# EAGLE schematic 7x6keyboard_untested (EAGLE 6.5.0)
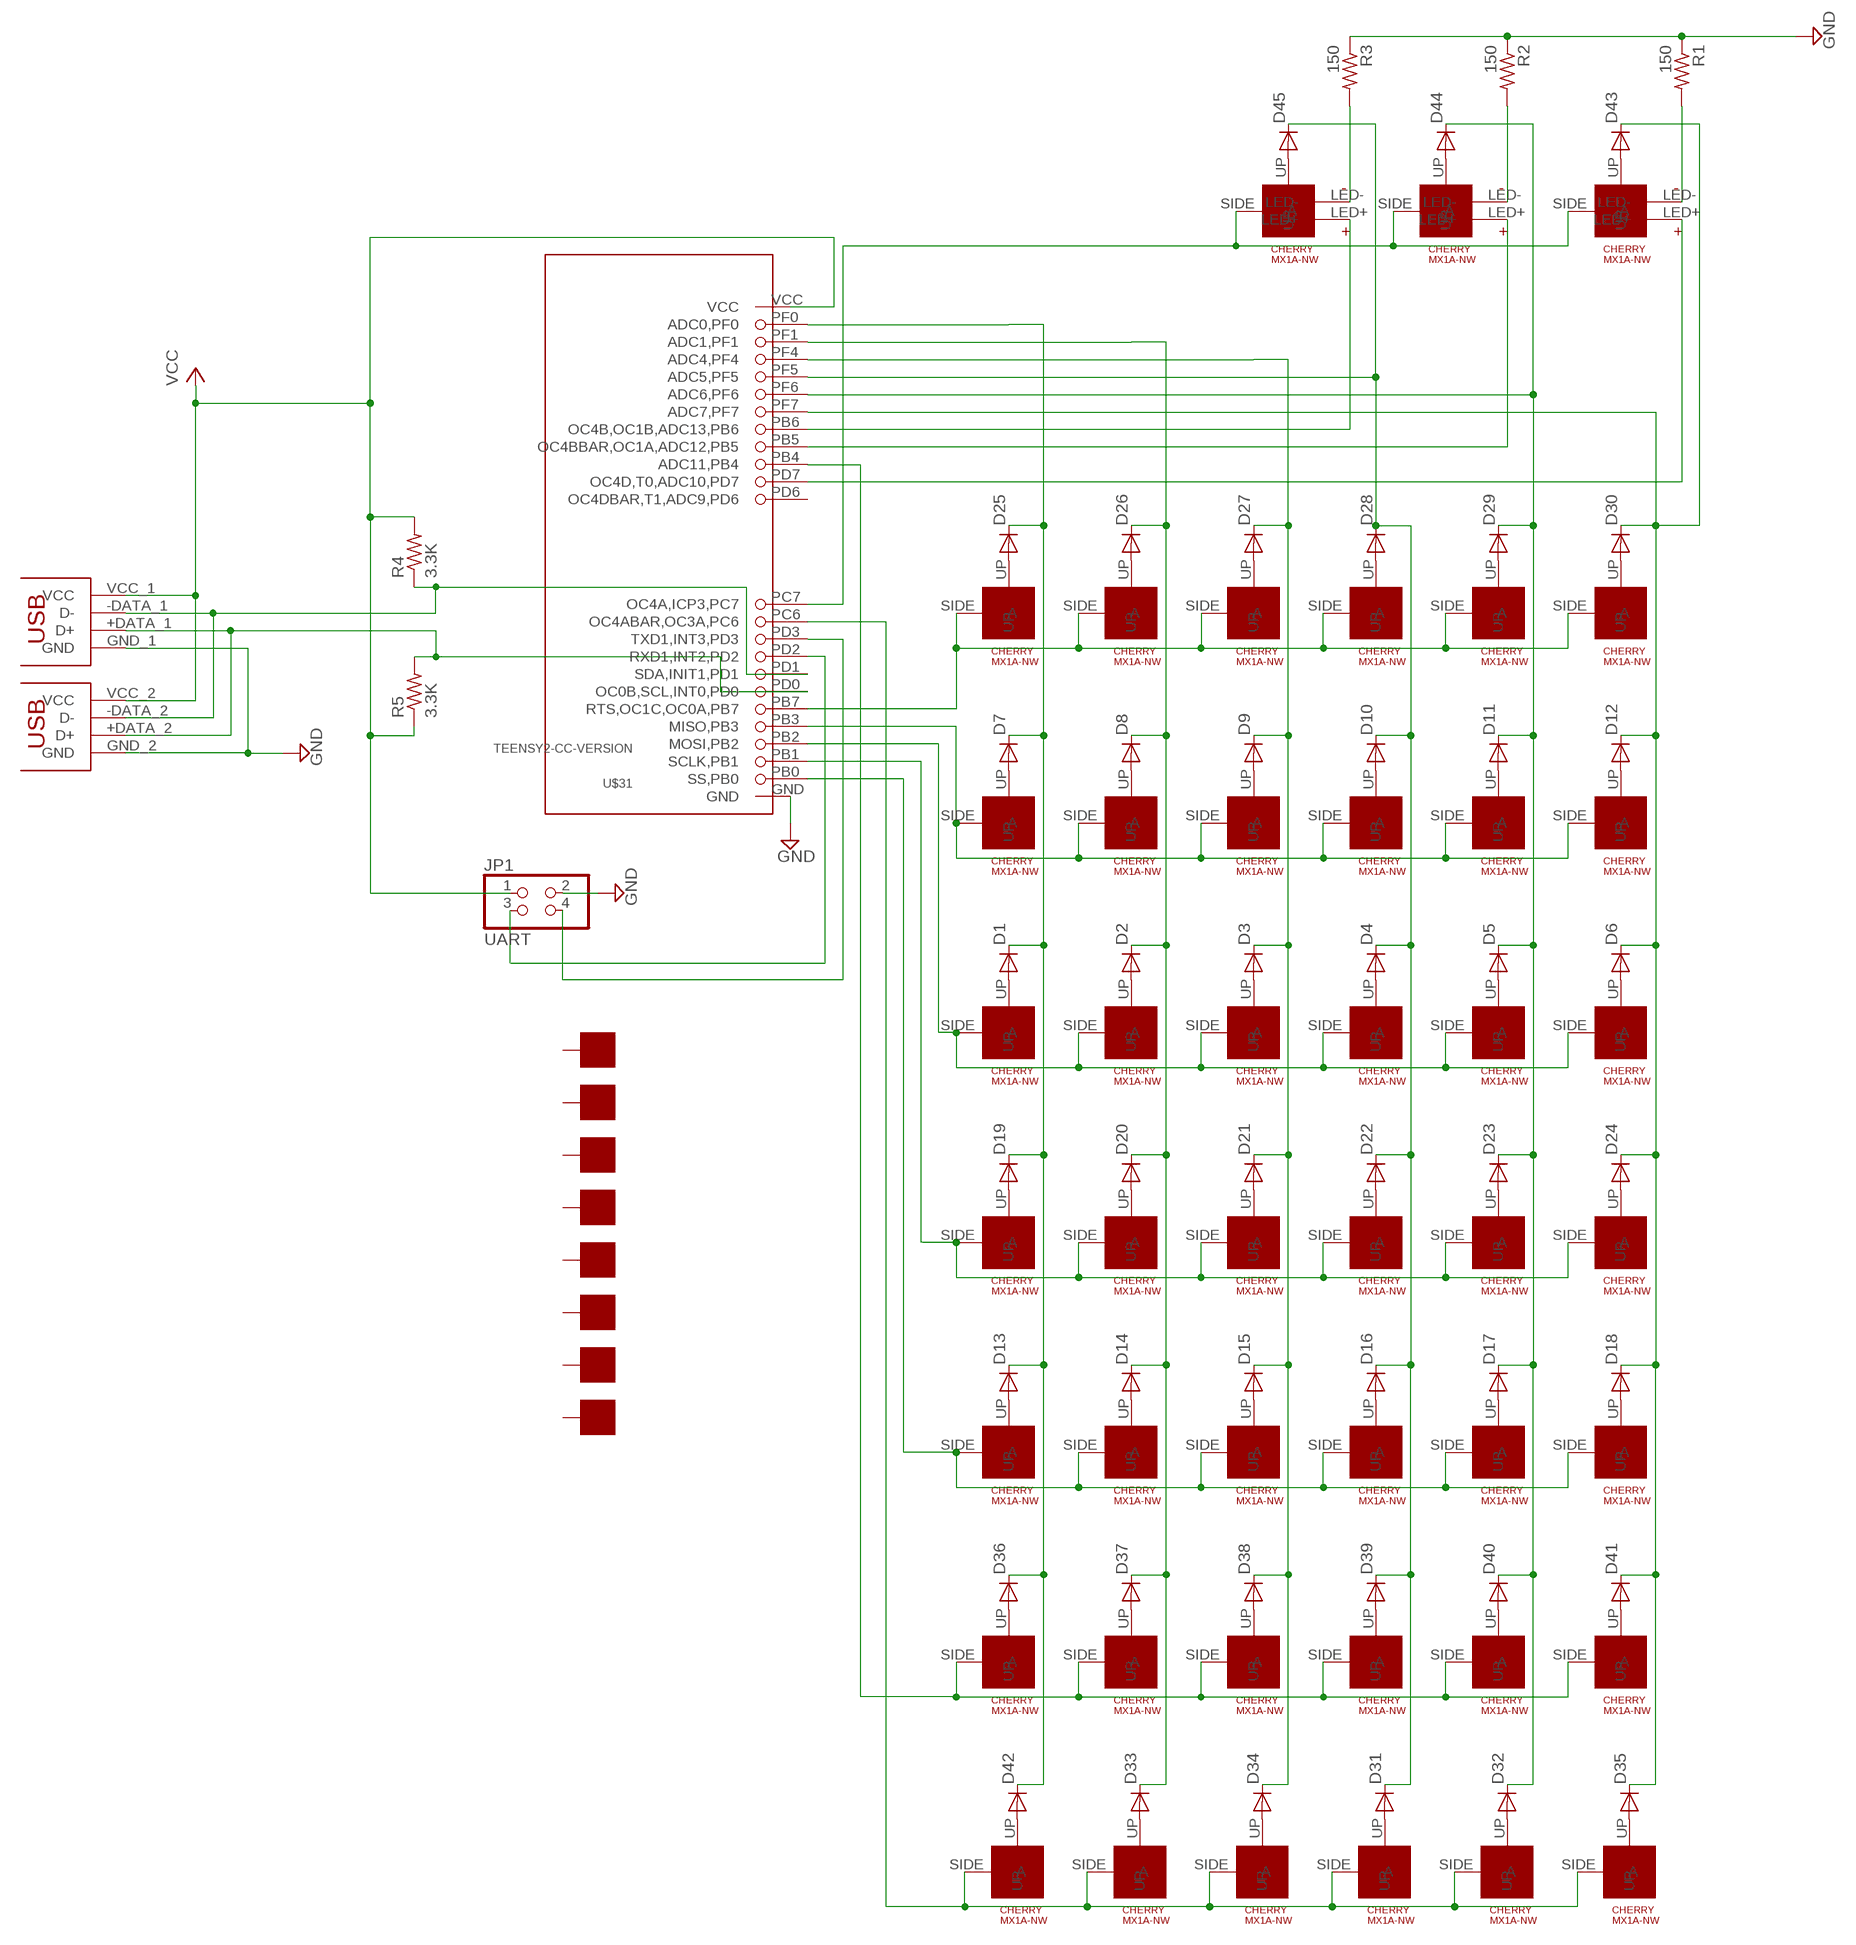
[diagram p0: schematic, sheet 1]

## Parts
D1  1N4148DO35-7  [DO35-7]
D2  1N4148DO35-7  [DO35-7]
D3  1N4148DO35-7  [DO35-7]
D4  1N4148DO35-7  [DO35-7]
D5  1N4148DO35-7  [DO35-7]
D6  1N4148DO35-7  [DO35-7]
D7  1N4148DO35-7  [DO35-7]
D8  1N4148DO35-7  [DO35-7]
D9  1N4148DO35-7  [DO35-7]
D10  1N4148DO35-7  [DO35-7]
D11  1N4148DO35-7  [DO35-7]
D12  1N4148DO35-7  [DO35-7]
D13  1N4148DO35-7  [DO35-7]
D14  1N4148DO35-7  [DO35-7]
D15  1N4148DO35-7  [DO35-7]
D16  1N4148DO35-7  [DO35-7]
D17  1N4148DO35-7  [DO35-7]
D18  1N4148DO35-7  [DO35-7]
D19  1N4148DO35-7  [DO35-7]
D20  1N4148DO35-7  [DO35-7]
D21  1N4148DO35-7  [DO35-7]
D22  1N4148DO35-7  [DO35-7]
D23  1N4148DO35-7  [DO35-7]
D24  1N4148DO35-7  [DO35-7]
D25  1N4148DO35-7  [DO35-7]
D26  1N4148DO35-7  [DO35-7]
D27  1N4148DO35-7  [DO35-7]
D28  1N4148DO35-7  [DO35-7]
D29  1N4148DO35-7  [DO35-7]
D30  1N4148DO35-7  [DO35-7]
D31  1N4148DO35-7  [DO35-7]
D32  1N4148DO35-7  [DO35-7]
D33  1N4148DO35-7  [DO35-7]
D34  1N4148DO35-7  [DO35-7]
D35  1N4148DO35-7  [DO35-7]
D36  1N4148DO35-7  [DO35-7]
D37  1N4148DO35-7  [DO35-7]
D38  1N4148DO35-7  [DO35-7]
D39  1N4148DO35-7  [DO35-7]
D40  1N4148DO35-7  [DO35-7]
D41  1N4148DO35-7  [DO35-7]
D42  1N4148DO35-7  [DO35-7]
D43  1N4148DO35-7  [DO35-7]
D44  1N4148DO35-7  [DO35-7]
D45  1N4148DO35-7  [DO35-7]
JP1  UART  PINHD-2X2  [2X02]
R1  150  R-US_0207/10  [0207/10]
R2  150  R-US_0207/10  [0207/10]
R3  150  R-US_0207/10  [0207/10]
R4  3.3K  R-US_0207/10  [0207/10]
R5  3.3K  R-US_0207/10  [0207/10]
U$1  CHERRY-MX1A-E1NW  [CHERRYMX-NN]
U$2  CHERRY-MX1A-E1NW  [CHERRYMX-NN]
U$3  CHERRY-MX1A-E1NW  [CHERRYMX-NN]
U$4  CHERRY-MX1A-E1NW  [CHERRYMX-NN]
U$5  CHERRY-MX1A-E1NW  [CHERRYMX-NN]
U$6  CHERRY-MX1A-E1NW  [CHERRYMX-NN]
U$7  CHERRY-MX1A-E1NW  [CHERRYMX-NN]
U$8  CHERRY-MX1A-E1NW  [CHERRYMX-NN]
U$9  CHERRY-MX1A-E1NW  [CHERRYMX-NN]
U$10  CHERRY-MX1A-E1NW  [CHERRYMX-NN]
U$11  CHERRY-MX1A-E1NW  [CHERRYMX-NN]
U$12  CHERRY-MX1A-E1NW  [CHERRYMX-NN]
U$13  CHERRY-MX1A-E1NW  [CHERRYMX-NN]
U$14  CHERRY-MX1A-E1NW  [CHERRYMX-NN]
U$15  CHERRY-MX1A-E1NW  [CHERRYMX-NN]
U$16  CHERRY-MX1A-E1NW  [CHERRYMX-NN]
U$17  CHERRY-MX1A-E1NW  [CHERRYMX-NN]
U$18  CHERRY-MX1A-E1NW  [CHERRYMX-NN]
U$19  CHERRY-MX1A-E1NW  [CHERRYMX-NN]
U$20  CHERRY-MX1A-E1NW  [CHERRYMX-NN]
U$21  CHERRY-MX1A-E1NW  [CHERRYMX-NN]
U$22  CHERRY-MX1A-E1NW  [CHERRYMX-NN]
U$23  CHERRY-MX1A-E1NW  [CHERRYMX-NN]
U$24  CHERRY-MX1A-E1NW  [CHERRYMX-NN]
U$25  CHERRY-MX1A-E1NW  [CHERRYMX-NN]
U$26  CHERRY-MX1A-E1NW  [CHERRYMX-NN]
U$27  CHERRY-MX1A-E1NW  [CHERRYMX-NN]
U$28  CHERRY-MX1A-E1NW  [CHERRYMX-NN]
U$29  CHERRY-MX1A-E1NW  [CHERRYMX-NN]
U$30  CHERRY-MX1A-E1NW  [CHERRYMX-NN]
U$31  TEENSY2-CC-VERSION  [TEENSY2]
U$32  CHERRY-MX1A-E1NW-LED  [CHERRYMX-NN-LED]
U$33  CHERRY-MX1A-E1NW-LED  [CHERRYMX-NN-LED]
U$34  CHERRY-MX1A-E1NW-LED  [CHERRYMX-NN-LED]
U$35  DUAL-USB-A  [DUAL-USB-A]
U$36  CHERRY-MX1A-E1NW  [CHERRYMX-NN]
U$37  CHERRY-MX1A-E1NW  [CHERRYMX-NN]
U$38  CHERRY-MX1A-E1NW  [CHERRYMX-NN]
U$39  CHERRY-MX1A-E1NW  [CHERRYMX-NN]
U$40  CHERRY-MX1A-E1NW  [CHERRYMX-NN]
U$41  CHERRY-MX1A-E1NW  [CHERRYMX-NN]
U$42  CHERRY-MX1A-E1NW  [CHERRYMX-NN]
U$43  CHERRY-MX1A-E1NW  [CHERRYMX-NN]
U$44  CHERRY-MX1A-E1NW  [CHERRYMX-NN]
U$45  CHERRY-MX1A-E1NW  [CHERRYMX-NN]
U$46  CHERRY-MX1A-E1NW  [CHERRYMX-NN]
U$47  CHERRY-MX1A-E1NW  [CHERRYMX-NN]
U$48  MOUNTING-PAD  [MOUNTING-PAD]
U$49  MOUNTING-PAD  [MOUNTING-PAD]
U$50  MOUNTING-PAD  [MOUNTING-PAD]
U$51  MOUNTING-PAD  [MOUNTING-PAD]
U$52  MOUNTING-PAD  [MOUNTING-PAD]
U$53  MOUNTING-PAD  [MOUNTING-PAD]
U$54  MOUNTING-PAD  [MOUNTING-PAD]
U$55  MOUNTING-PAD  [MOUNTING-PAD]

## Nets
GND: JP1.2 R1.1 R2.1 R3.1 U$31.GND U$35.GND_1(GND) U$35.GND_2(GND)
N$1: D1.A U$2.UP
N$2: D2.A U$1.UP
N$3: D3.A U$3.UP
N$4: D4.A U$4.UP
N$5: D5.A U$5.UP
N$6: D6.A U$6.UP
N$7: D7.A U$7.UP
N$8: D8.A U$8.UP
N$9: D9.A U$9.UP
N$10: D10.A U$10.UP
N$11: D11.A U$11.UP
N$12: D12.A U$12.UP
N$13: D13.A U$13.UP
N$14: D14.A U$14.UP
N$15: D15.A U$15.UP
N$16: D16.A U$16.UP
N$17: D17.A U$17.UP
N$18: D18.A U$18.UP
N$19: D19.A U$19.UP
N$20: D20.A U$20.UP
N$21: D21.A U$21.UP
N$22: D22.A U$22.UP
N$23: D23.A U$23.UP
N$24: D24.A U$24.UP
N$25: D25.A U$25.UP
N$26: D26.A U$26.UP
N$27: D27.A U$27.UP
N$28: D28.A U$28.UP
N$29: D29.A U$29.UP
N$30: D30.A U$30.UP
N$31: D1.C D7.C D13.C D19.C D25.C D36.C D42.C U$31.PF0(ADC0,PF0)
N$32: D2.C D8.C D14.C D20.C D26.C D33.C D37.C U$31.PF1(ADC1,PF1)
N$33: D3.C D9.C D15.C D21.C D27.C D34.C D38.C U$31.PF4(ADC4,PF4)
N$34: D4.C D10.C D16.C D22.C D28.C D31.C D39.C D45.C U$31.PF5(ADC5,PF5)
N$35: D5.C D11.C D17.C D23.C D29.C D32.C D40.C D44.C U$31.PF6(ADC6,PF6)
N$36: D6.C D12.C D18.C D24.C D30.C D35.C D41.C D43.C U$31.PF7(ADC7,PF7)
N$37: U$19.SIDE(A) U$20.SIDE(A) U$21.SIDE(A) U$22.SIDE(A) U$23.SIDE(A) U$24.SIDE(A) U$31.PB1(SCLK,PB1)
N$38: U$1.SIDE(A) U$2.SIDE(A) U$3.SIDE(A) U$4.SIDE(A) U$5.SIDE(A) U$6.SIDE(A) U$31.PB2(MOSI,PB2)
N$39: U$7.SIDE(A) U$8.SIDE(A) U$9.SIDE(A) U$10.SIDE(A) U$11.SIDE(A) U$12.SIDE(A) U$31.PB3(MISO,PB3)
N$40: U$25.SIDE(A) U$26.SIDE(A) U$27.SIDE(A) U$28.SIDE(A) U$29.SIDE(A) U$30.SIDE(A) U$31.PB7(RTS,OC1C,OC0A,PB7)
N$41: U$13.SIDE(A) U$14.SIDE(A) U$15.SIDE(A) U$16.SIDE(A) U$17.SIDE(A) U$18.SIDE(A) U$31.PB0(SS,PB0)
N$42: R1.2 U$32.LED-
N$43: R2.2 U$33.LED-
N$44: R3.2 U$34.LED-
N$45: JP1.3 U$31.PD2(RXD1,INT2,PD2)
N$46: D36.A U$41.UP
N$47: D37.A U$42.UP
N$48: D45.A U$34.UP
N$49: U$31.PB5(OC4BBAR,OC1A,ADC12,PB5) U$33.LED+
N$50: D43.A U$32.UP
N$51: D31.A U$36.UP
N$52: D32.A U$37.UP
N$53: D33.A U$38.UP
N$54: D38.A U$43.UP
N$55: JP1.4 U$31.PD3(TXD1,INT3,PD3)
N$56: D34.A U$39.UP
N$57: R4.1 U$31.PD1(SDA,INIT1,PD1) U$35.-DATA_1(D-) U$35.-DATA_2(D-)
N$58: R5.2 U$31.PD0(OC0B,SCL,INT0,PD0) U$35.+DATA_1(D+) U$35.+DATA_2(D+)
N$59: D35.A U$40.UP
N$60: U$31.PC6(OC4ABAR,OC3A,PC6) U$36.SIDE(A) U$37.SIDE(A) U$38.SIDE(A) U$39.SIDE(A) U$40.SIDE(A) U$47.SIDE(A)
N$61: D39.A U$44.UP
N$62: D40.A U$45.UP
N$63: D41.A U$46.UP
N$64: U$31.PB4(ADC11,PB4) U$41.SIDE(A) U$42.SIDE(A) U$43.SIDE(A) U$44.SIDE(A) U$45.SIDE(A) U$46.SIDE(A)
N$65: D42.A U$47.UP
N$67: D44.A U$33.UP
N$68: U$31.PD7(OC4D,T0,ADC10,PD7) U$32.LED+
N$69: U$31.PC7(OC4A,ICP3,PC7) U$32.SIDE(A) U$33.SIDE(A) U$34.SIDE(A)
N$70: U$31.PB6(OC4B,OC1B,ADC13,PB6) U$34.LED+
VCC: JP1.1 R4.2 R5.1 U$31.VCC U$35.VCC_1(VCC) U$35.VCC_2(VCC)
Unconnected: U$31.PD6(OC4DBAR,T1,ADC9,PD6) U$48.P$1 U$49.P$1 U$50.P$1 U$51.P$1 U$52.P$1 U$53.P$1 U$54.P$1 U$55.P$1

## Library data of the parts
D1-D45 = diode:1N4148: DIODE high speed (Philips)
JP1 = pinhead:PINHD-2X2: PIN HEADER
R1-R3 = rcl:R-US_: RESISTOR, American symbol
R4 R5 = resistor:R-US_: RESISTOR, American symbol
U$1-U$30 U$36-U$47 = my_parts:CHERRY-MX1A-E1NW: Cherry MX NW key
U$31 = teensy2:TEENSY2-C
U$32-U$34 = my_parts:CHERRY-MX1A-E1NW-LED: A cherry MX NW switch, but also with a place to put a LED
U$35 = my_parts:DUAL-USB-A: A Dual-USB A jack.
U$48-U$55 = my_parts:MOUNTING-PAD